# EAGLE design RPI_M_LED (EAGLE 7.6.0)
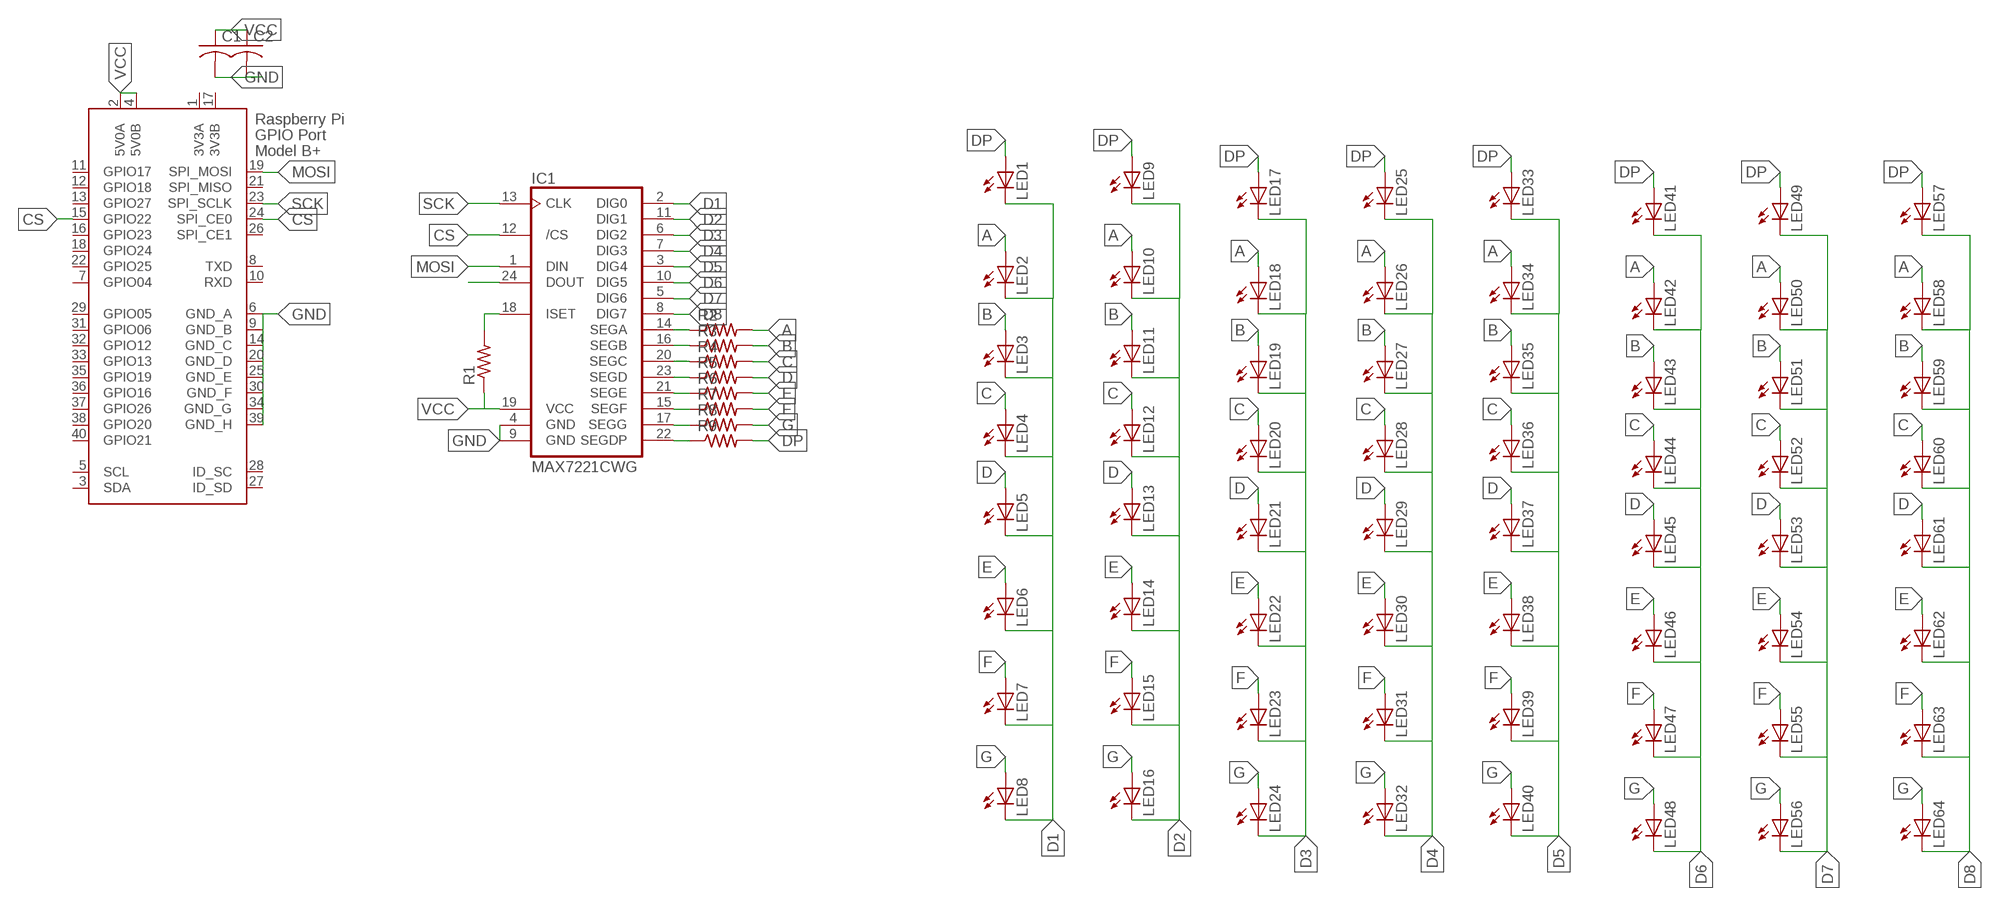
[diagram p0: schematic, sheet 1]

## Parts
C1  C-USC0805  [C0805]
C2  C-USC0805  [C0805]
IC1  MAX7221CWG  [SO24W]
LED1  LEDCHIPLED_0603  [CHIPLED_0603]
LED2  LEDCHIPLED_0603  [CHIPLED_0603]
LED3  LEDCHIPLED_0603  [CHIPLED_0603]
LED4  LEDCHIPLED_0603  [CHIPLED_0603]
LED5  LEDCHIPLED_0603  [CHIPLED_0603]
LED6  LEDCHIPLED_0603  [CHIPLED_0603]
LED7  LEDCHIPLED_0603  [CHIPLED_0603]
LED8  LEDCHIPLED_0603  [CHIPLED_0603]
LED9  LEDCHIPLED_0603  [CHIPLED_0603]
LED10  LEDCHIPLED_0603  [CHIPLED_0603]
LED11  LEDCHIPLED_0603  [CHIPLED_0603]
LED12  LEDCHIPLED_0603  [CHIPLED_0603]
LED13  LEDCHIPLED_0603  [CHIPLED_0603]
LED14  LEDCHIPLED_0603  [CHIPLED_0603]
LED15  LEDCHIPLED_0603  [CHIPLED_0603]
LED16  LEDCHIPLED_0603  [CHIPLED_0603]
LED17  LEDCHIPLED_0603  [CHIPLED_0603]
LED18  LEDCHIPLED_0603  [CHIPLED_0603]
LED19  LEDCHIPLED_0603  [CHIPLED_0603]
LED20  LEDCHIPLED_0603  [CHIPLED_0603]
LED21  LEDCHIPLED_0603  [CHIPLED_0603]
LED22  LEDCHIPLED_0603  [CHIPLED_0603]
LED23  LEDCHIPLED_0603  [CHIPLED_0603]
LED24  LEDCHIPLED_0603  [CHIPLED_0603]
LED25  LEDCHIPLED_0603  [CHIPLED_0603]
LED26  LEDCHIPLED_0603  [CHIPLED_0603]
LED27  LEDCHIPLED_0603  [CHIPLED_0603]
LED28  LEDCHIPLED_0603  [CHIPLED_0603]
LED29  LEDCHIPLED_0603  [CHIPLED_0603]
LED30  LEDCHIPLED_0603  [CHIPLED_0603]
LED31  LEDCHIPLED_0603  [CHIPLED_0603]
LED32  LEDCHIPLED_0603  [CHIPLED_0603]
LED33  LEDCHIPLED_0603  [CHIPLED_0603]
LED34  LEDCHIPLED_0603  [CHIPLED_0603]
LED35  LEDCHIPLED_0603  [CHIPLED_0603]
LED36  LEDCHIPLED_0603  [CHIPLED_0603]
LED37  LEDCHIPLED_0603  [CHIPLED_0603]
LED38  LEDCHIPLED_0603  [CHIPLED_0603]
LED39  LEDCHIPLED_0603  [CHIPLED_0603]
LED40  LEDCHIPLED_0603  [CHIPLED_0603]
LED41  LEDCHIPLED_0603  [CHIPLED_0603]
LED42  LEDCHIPLED_0603  [CHIPLED_0603]
LED43  LEDCHIPLED_0603  [CHIPLED_0603]
LED44  LEDCHIPLED_0603  [CHIPLED_0603]
LED45  LEDCHIPLED_0603  [CHIPLED_0603]
LED46  LEDCHIPLED_0603  [CHIPLED_0603]
LED47  LEDCHIPLED_0603  [CHIPLED_0603]
LED48  LEDCHIPLED_0603  [CHIPLED_0603]
LED49  LEDCHIPLED_0603  [CHIPLED_0603]
LED50  LEDCHIPLED_0603  [CHIPLED_0603]
LED51  LEDCHIPLED_0603  [CHIPLED_0603]
LED52  LEDCHIPLED_0603  [CHIPLED_0603]
LED53  LEDCHIPLED_0603  [CHIPLED_0603]
LED54  LEDCHIPLED_0603  [CHIPLED_0603]
LED55  LEDCHIPLED_0603  [CHIPLED_0603]
LED56  LEDCHIPLED_0603  [CHIPLED_0603]
LED57  LEDCHIPLED_0603  [CHIPLED_0603]
LED58  LEDCHIPLED_0603  [CHIPLED_0603]
LED59  LEDCHIPLED_0603  [CHIPLED_0603]
LED60  LEDCHIPLED_0603  [CHIPLED_0603]
LED61  LEDCHIPLED_0603  [CHIPLED_0603]
LED62  LEDCHIPLED_0603  [CHIPLED_0603]
LED63  LEDCHIPLED_0603  [CHIPLED_0603]
LED64  LEDCHIPLED_0603  [CHIPLED_0603]
R1  R-US_R0805  [R0805]
R2  R-US_R0603  [R0603]
R3  R-US_R0603  [R0603]
R4  R-US_R0603  [R0603]
R5  R-US_R0603  [R0603]
R6  R-US_R0603  [R0603]
R7  R-US_R0603  [R0603]
R8  R-US_R0603  [R0603]
R9  R-US_R0603  [R0603]
X1  RASPI_GPIO_B+#_PIN  [RASPI_GPIO_B+_PIN]

## Nets
A: LED2.A LED10.A LED18.A LED26.A LED34.A LED42.A LED50.A LED58.A R2.2
B: LED3.A LED11.A LED19.A LED27.A LED35.A LED43.A LED51.A LED59.A R3.2
C: LED4.A LED12.A LED20.A LED28.A LED36.A LED44.A LED52.A LED60.A R4.2
CS: IC1.12(/CS) X1.15(GPIO22) X1.24(SPI_CE0)
D: LED5.A LED13.A LED21.A LED29.A LED37.A LED45.A LED53.A LED61.A R5.2
D1: IC1.2(DIG0) LED1.C LED2.C LED3.C LED4.C LED5.C LED6.C LED7.C LED8.C
D2: IC1.11(DIG1) LED9.C LED10.C LED11.C LED12.C LED13.C LED14.C LED15.C LED16.C
D3: IC1.6(DIG2) LED17.C LED18.C LED19.C LED20.C LED21.C LED22.C LED23.C LED24.C
D4: IC1.7(DIG3) LED25.C LED26.C LED27.C LED28.C LED29.C LED30.C LED31.C LED32.C
D5: IC1.3(DIG4) LED33.C LED34.C LED35.C LED36.C LED37.C LED38.C LED39.C LED40.C
D6: IC1.10(DIG5) LED41.C LED42.C LED43.C LED44.C LED45.C LED46.C LED47.C LED48.C
D7: IC1.5(DIG6) LED49.C LED50.C LED51.C LED52.C LED53.C LED54.C LED55.C LED56.C
D8: IC1.8(DIG7) LED57.C LED58.C LED59.C LED60.C LED61.C LED62.C LED63.C LED64.C
DP: LED1.A LED9.A LED17.A LED25.A LED33.A LED41.A LED49.A LED57.A R9.2
E: LED6.A LED14.A LED22.A LED30.A LED38.A LED46.A LED54.A LED62.A R6.2
F: LED7.A LED15.A LED23.A LED31.A LED39.A LED47.A LED55.A LED63.A R7.2
G: LED8.A LED16.A LED24.A LED32.A LED40.A LED48.A LED56.A LED64.A R8.2
GND: C1.2 C2.2 IC1.4(GND) IC1.9(GND) X1.6(GND_A) X1.9(GND_B) X1.14(GND_C) X1.20(GND_D) X1.25(GND_E) X1.30(GND_F) X1.34(GND_G) X1.39(GND_H)
MOSI: IC1.1(DIN) X1.19(SPI_MOSI)
N$1: IC1.14(SEGA) R2.1
N$2: IC1.16(SEGB) R3.1
N$3: IC1.20(SEGC) R4.1
N$4: IC1.24(DOUT)
N$5: IC1.23(SEGD) R5.1
N$6: IC1.21(SEGE) R6.1
N$7: IC1.18(ISET) R1.2
N$8: IC1.15(SEGF) R7.1
N$9: IC1.17(SEGG) R8.1
N$10: IC1.22(SEGDP) R9.1
SCK: IC1.13(CLK) X1.23(SPI_SCLK)
VCC: C1.1 C2.1 IC1.19(VCC) R1.1 X1.2(5V0A) X1.4(5V0B)
Unconnected: X1.3(SDA) X1.5(SCL) X1.7(GPIO04) X1.8(TXD) X1.10(RXD) X1.11(GPIO17) X1.12(GPIO18) X1.13(GPIO27) X1.16(GPIO23) X1.18(GPIO24) X1.21(SPI_MISO) X1.22(GPIO25) X1.26(SPI_CE1) X1.27(ID_SD) X1.28(ID_SC) X1.29(GPIO05) X1.31(GPIO06) X1.32(GPIO12) X1.33(GPIO13) X1.35(GPIO19) X1.36(GPIO16) X1.37(GPIO26) X1.38(GPIO20) X1.40(GPIO21)

## Power pins joined to a net without a drawn wire
3V3A: X1.1(3V3A)
3V3B: X1.17(3V3B)

## Library data of the parts
C1 C2 = adafruit:C-US: CAPACITOR, American symbol
IC1 = maxim-8:MAX7221*: Serially Interfaced, 8-Digit LED Display Drivers
LED1-LED64 = adafruit:LED: LED OSRAM: - CHIPLED LG R971, LG N971, LY N971, LG Q971, LY Q971, LO R971, LY R971 LH N974, LH R974 LS Q976, LO Q976, LY Q976 LO Q996 - Hyper CHIPLED LW Q18S LB Q993, LB Q99A, LB R99A - SideLED LS A670, LO A670, LY A670, LG A670, LP A670 LB A673, LV A673, LT A673, LW A673 LH A674 LY A675 LS A676, LA A676, LO A676, LY A676, LW A676 LS A679, LY A679, LG A679 - Hyper Micro SIDELED® LS Y876, LA Y876, LO Y876, LY Y876 LT Y87S - SmartLED LW L88C, LW L88S LB L89C, LB L89S, LG L890 LS L89K, LO L89K, LY L89K LS L896, LA L896, LO L896, LY L896 - TOPLED LS T670, LO T670, LY T670, LG T670, LP T670 LSG T670, LSP T670, LSY T670, LOP T670, LYG T670 LG T671, LOG T671, LSG T671 LB T673, LV T673, LT T673, LW T673 LH T674 LS T676, LA T676, LO T676, LY T676, LB T676, LH T676, LSB T676, LW T676 LB T67C, LV T67C, LT T67C, LS T67K, LO T67K, LY T67K, LW E67C LS E67B, LA E67B, LO E67B, LY E67B, LB E67C, LV E67C, LT E67C LW T67C LS T679, LY T679, LG T679 LS T770, LO T770, LY T770, LG T770, LP T770 LB T773, LV T773, LT T773, LW T773 LH T774 LS E675, LA E675, LY E675, LS T675 LS T776, LA T776, LO T776, LY T776, LB T776 LHGB T686 LT T68C, LB T68C - Hyper Mini TOPLED® LB M676 - Mini TOPLED Santana® LG M470 LS M47K, LO M47K, LY M47K Source: http://www.osram.convergy.de/
R1-R9 = adafruit:R-US_: RESISTOR, American symbol
X1 = raspberrypi_bastelstube_v13:RASPI_GPIO_B+#: 2x20 header connector, all pins connected

## Board
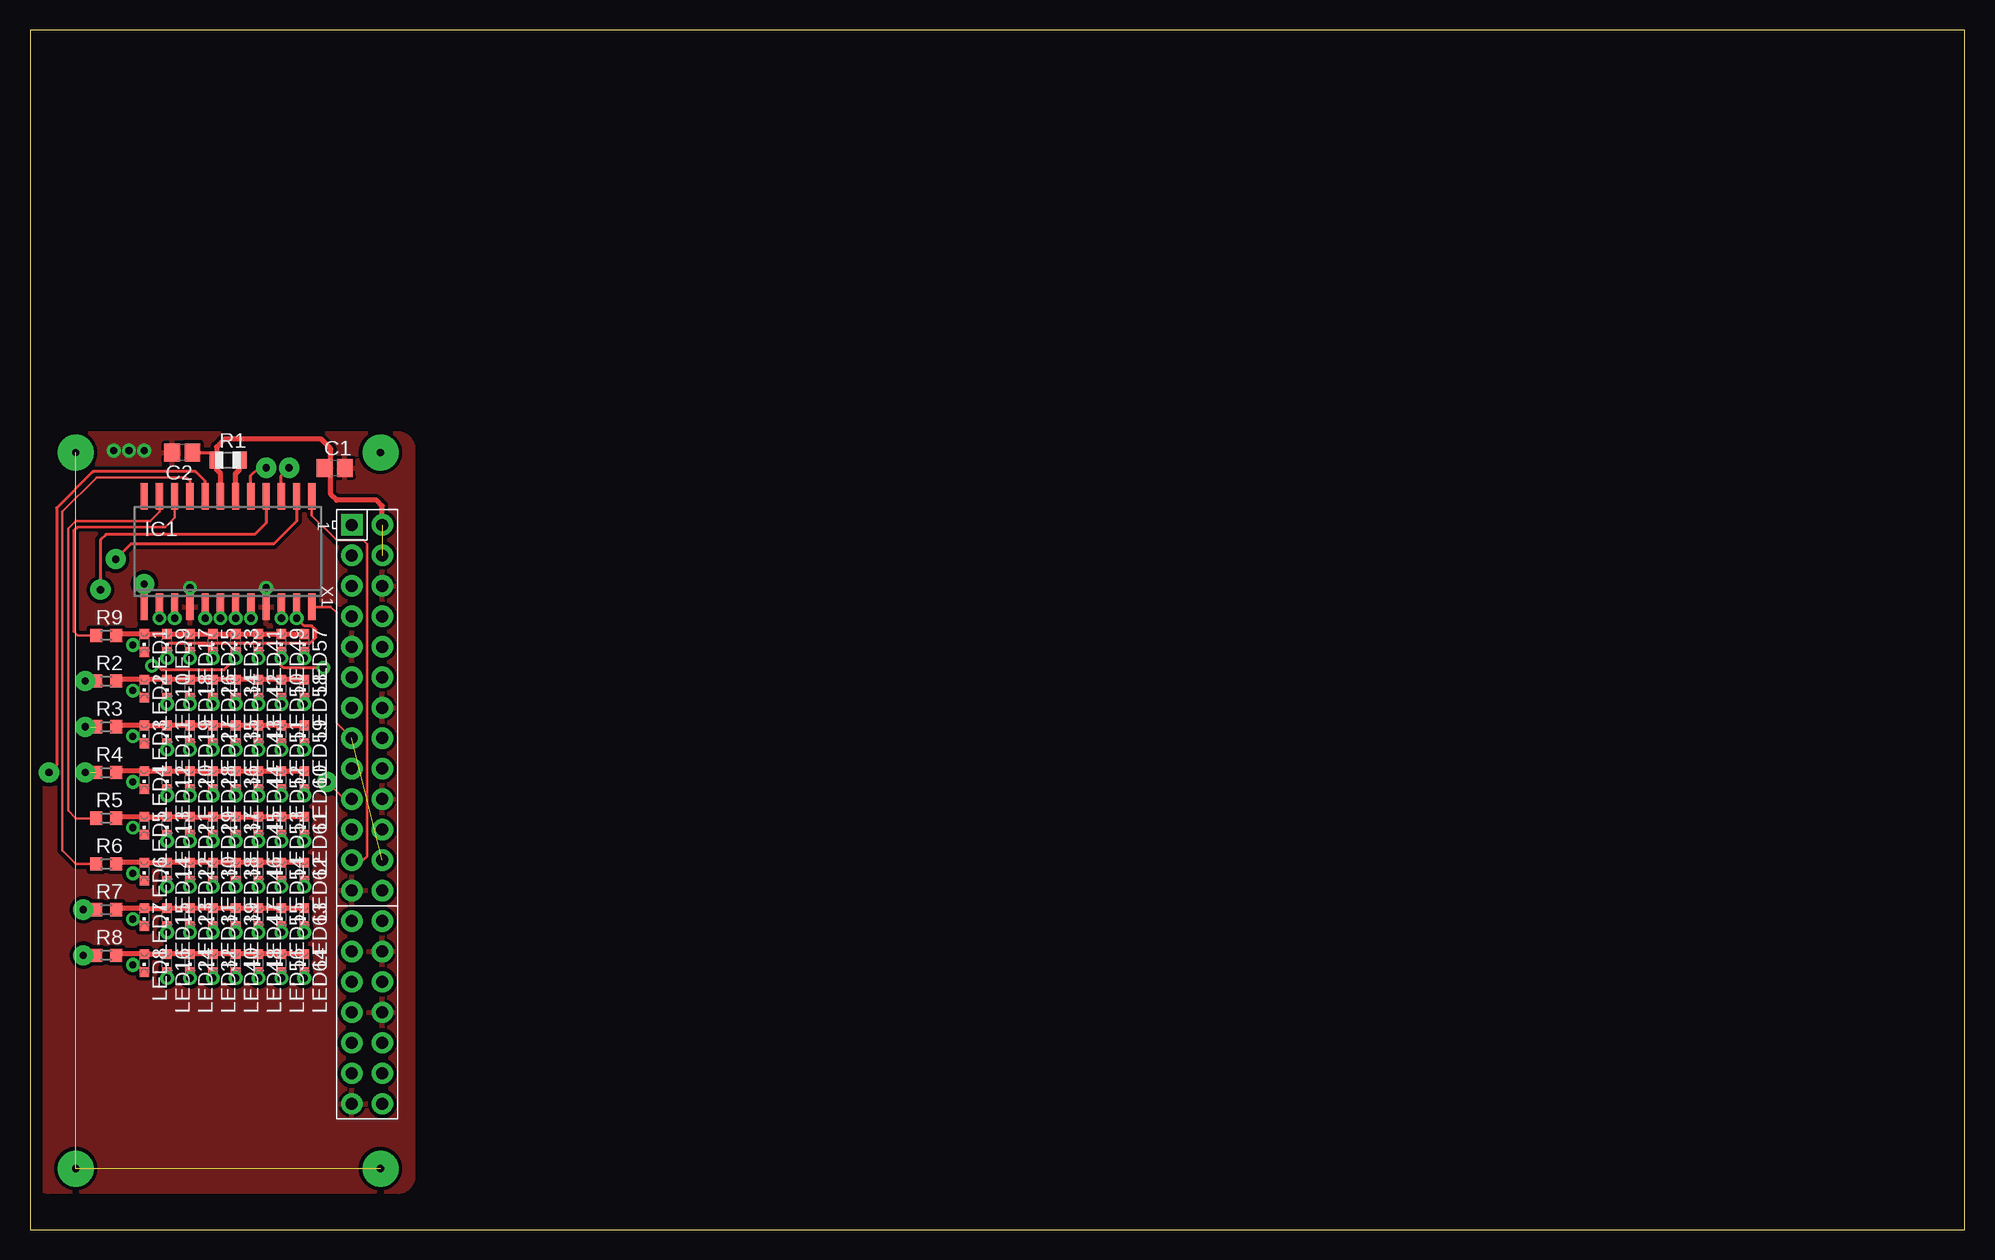
[diagram p1: board, top side]
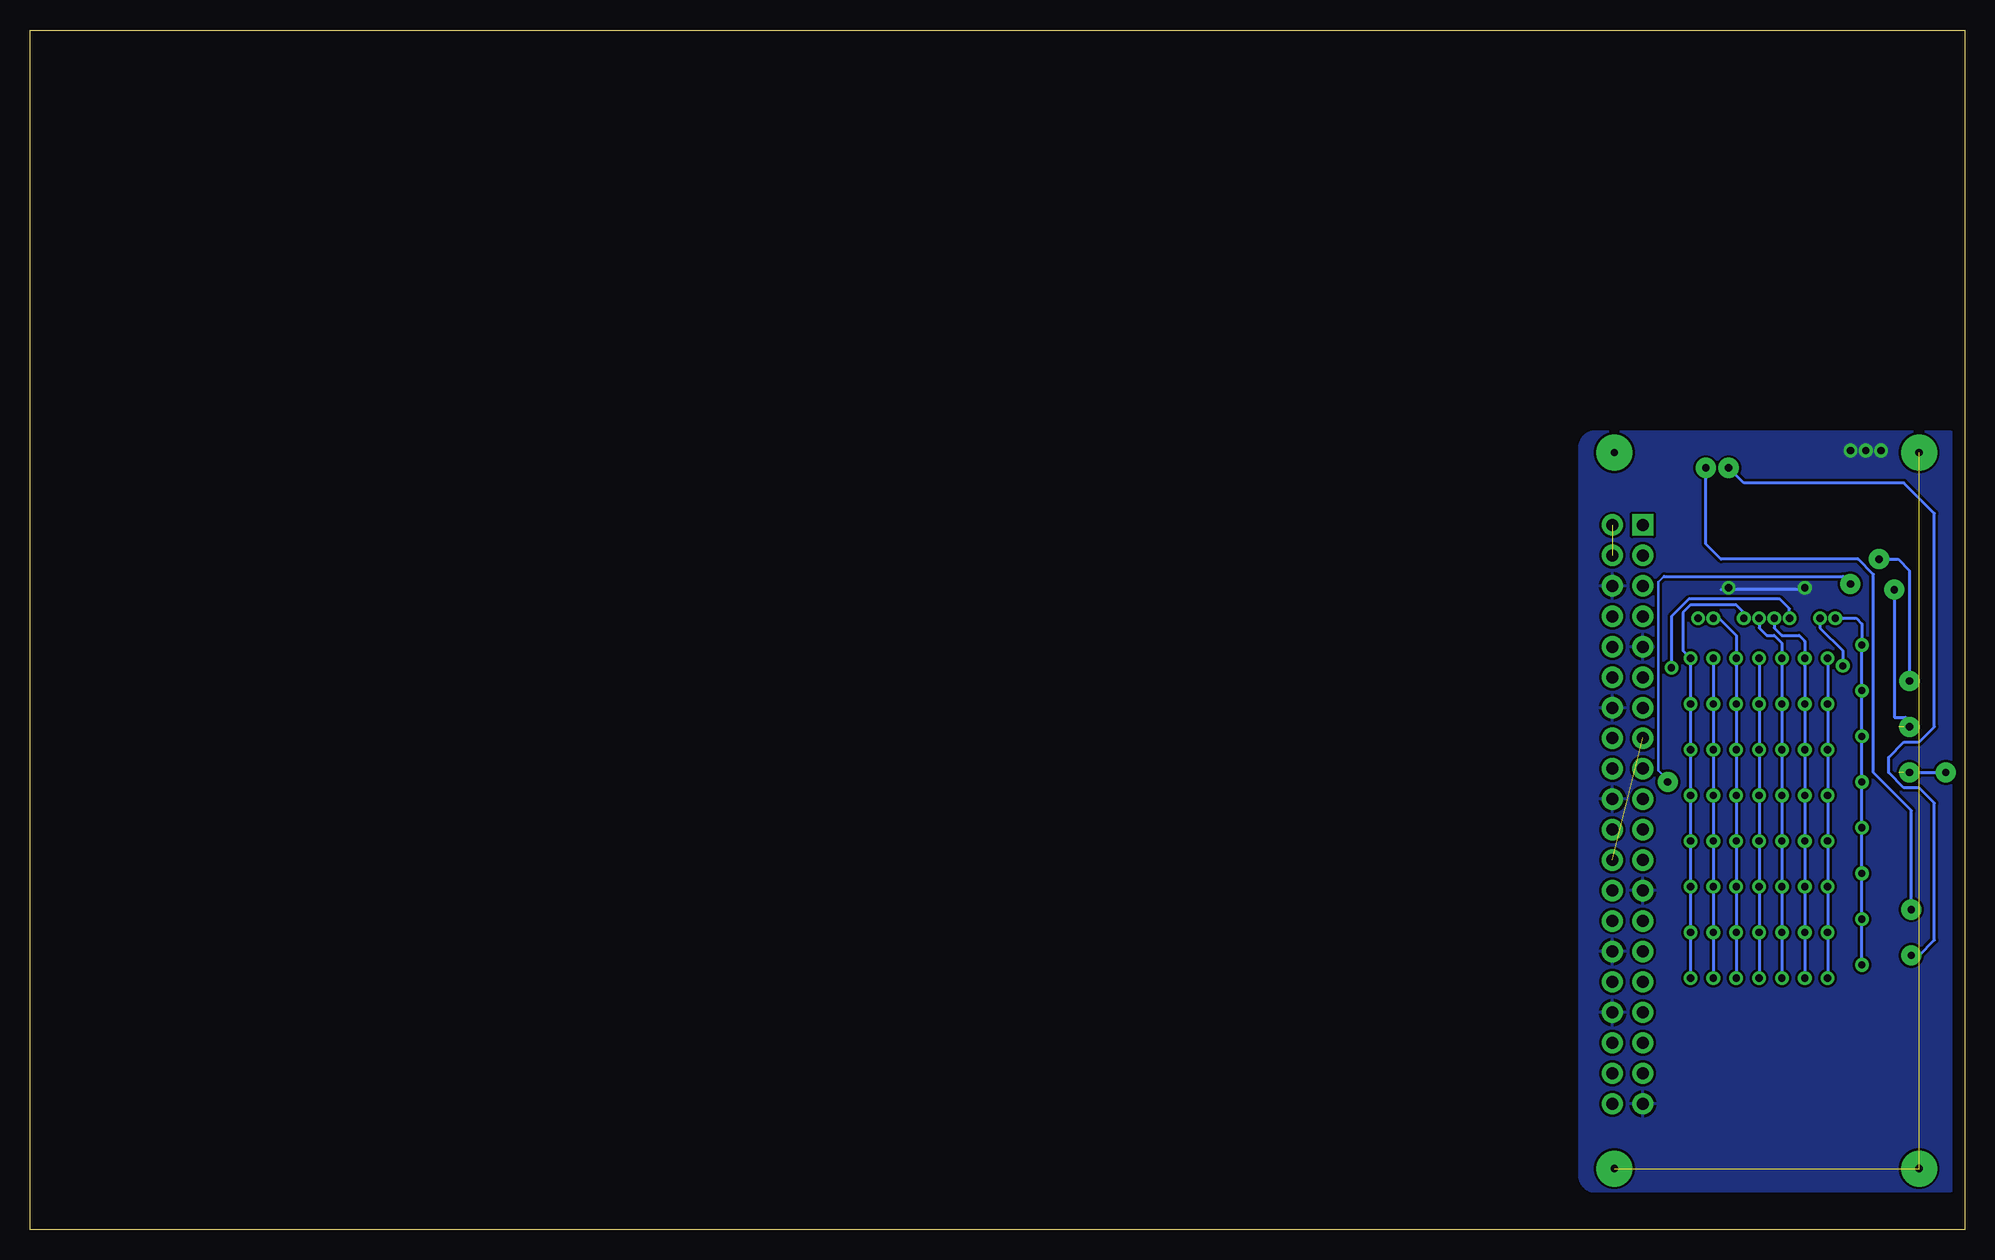
[diagram p2: board, bottom side, seen from below]

Size 161.27 x 100 mm. Coordinates in mm from the lower left corner, seen from the top.
Outline: 0,0 161.27,0 161.27,100 0,100 0,0
Copper layers (1*16): Top 0.035mm / dielectric 1.5mm / Bottom 0.035mm
Design rules "default": minimum track width 10mil, minimum drill 24mil, track to track 8mil, track to pad 8mil, pad to pad 8mil, via to via 8mil, smd to smd 8mil, copper to edge 40mil, drill to drill 8mil, minimum pad ring 10mil, minimum via ring 8mil, stop-mask expansion 4mil, vias tented up to drill 0mil, thermal gap 10mil

### Footprints (pad centres in the part's own frame; a part is rotated, then mirrored left to right if it is on the bottom)
C0805 = smd 1.3 x 1.5: 1 -0.85,0; 2 0.85,0
SO24W = smd 0.6 x 2.2: 1 -6.985,-4.6; 2 -5.715,-4.6; 3 -4.445,-4.6; 4 -3.175,-4.6; 5 -1.905,-4.6; 6 -0.635,-4.6; 7 0.635,-4.6; 8 1.905,-4.6; 9 3.175,-4.6; 10 4.445,-4.6; 11 5.715,-4.6; 12 6.985,-4.6; 13 6.985,4.6; 14 5.715,4.6; 15 4.445,4.6; 16 3.175,4.6; 17 1.905,4.6; 18 0.635,4.6; 19 -0.635,4.6; 20 -1.905,4.6; 21 -3.175,4.6; 22 -4.445,4.6; 23 -5.715,4.6; 24 -6.985,4.6
CHIPLED_0603 = smd 0.8 x 0.8: A 0,-0.75; C 0,0.75
R0805 = smd 1.1 x 1.4: 1 -1,0; 2 1,0
R0603 = smd 1 x 1.1: 1 -0.85,0; 2 0.85,0
RASPI_GPIO_B+_PIN = drill 1 pad 1.778 square: 1 -24.13,-1.27 | drill 1 pad 1.778: 2 -24.13,1.27; 3 -21.59,-1.27; 4 -21.59,1.27; 5 -19.05,-1.27; 6 -19.05,1.27; 7 -16.51,-1.27; 8 -16.51,1.27; 9 -13.97,-1.27; 10 -13.97,1.27; 11 -11.43,-1.27; 12 -11.43,1.27; 13 -8.89,-1.27; 14 -8.89,1.27; 15 -6.35,-1.27; 16 -6.35,1.27; 17 -3.81,-1.27; 18 -3.81,1.27; 19 -1.27,-1.27; 20 -1.27,1.27; 21 1.27,-1.27; 22 1.27,1.27; 23 3.81,-1.27; 24 3.81,1.27; 25 6.35,-1.27; 26 6.35,1.27; 27 8.89,-1.27; 28 8.89,1.27; 29 11.43,-1.27; 30 11.43,1.27; 31 13.97,-1.27; 32 13.97,1.27; 33 16.51,-1.27; 34 16.51,1.27; 35 19.05,-1.27; 36 19.05,1.27; 37 21.59,-1.27; 38 21.59,1.27; 39 24.13,-1.27; 40 24.13,1.27

### Placement (x,y rotation side)
C1  25.4,63.5 0 top
C2  12.7,64.77 180 top
IC1  16.51,56.52 0 top
LED1  9.53,48.9 180 top
LED2  9.53,45.09 180 top
LED3  9.53,41.27 180 top
LED4  9.53,37.47 180 top
LED5  9.53,33.66 180 top
LED6  9.53,29.84 180 top
LED7  9.53,26.04 180 top
LED8  9.53,22.23 180 top
LED9  11.43,48.9 180 top
LED10  11.43,45.09 180 top
LED11  11.43,41.27 180 top
LED12  11.43,37.47 180 top
LED13  11.43,33.66 180 top
LED14  11.43,29.84 180 top
LED15  11.43,26.04 180 top
LED16  11.43,22.23 180 top
LED17  13.33,48.9 180 top
LED18  13.33,45.09 180 top
LED19  13.33,41.27 180 top
LED20  13.33,37.47 180 top
LED21  13.33,33.66 180 top
LED22  13.33,29.84 180 top
LED23  13.33,26.04 180 top
LED24  13.33,22.23 180 top
LED25  15.24,48.9 180 top
LED26  15.24,45.09 180 top
LED27  15.24,41.27 180 top
LED28  15.24,37.47 180 top
LED29  15.24,33.66 180 top
LED30  15.24,29.84 180 top
LED31  15.24,26.04 180 top
LED32  15.24,22.23 180 top
LED33  17.14,48.9 180 top
LED34  17.14,45.09 180 top
LED35  17.14,41.27 180 top
LED36  17.14,37.47 180 top
LED37  17.14,33.66 180 top
LED38  17.14,29.84 180 top
LED39  17.14,26.04 180 top
LED40  17.14,22.23 180 top
LED41  19.05,48.9 180 top
LED42  19.05,45.09 180 top
LED43  19.05,41.27 180 top
LED44  19.05,37.47 180 top
LED45  19.05,33.66 180 top
LED46  19.05,29.84 180 top
LED47  19.05,26.04 180 top
LED48  19.05,22.23 180 top
LED49  20.95,48.9 180 top
LED50  20.95,45.09 180 top
LED51  20.95,41.27 180 top
LED52  20.95,37.47 180 top
LED53  20.95,33.66 180 top
LED54  20.95,29.84 180 top
LED55  20.95,26.04 180 top
LED56  20.95,22.23 180 top
LED57  22.86,48.9 180 top
LED58  22.86,45.09 180 top
LED59  22.86,41.27 180 top
LED60  22.86,37.47 180 top
LED61  22.86,33.66 180 top
LED62  22.86,29.84 180 top
LED63  22.86,26.04 180 top
LED64  22.86,22.23 180 top
R1  16.51,64.14 0 top
R2  6.35,45.72 0 top
R3  6.35,41.91 0 top
R4  6.35,38.1 0 top
R5  6.35,34.29 0 top
R6  6.35,30.48 0 top
R7  6.35,26.67 0 top
R8  6.35,22.86 0 top
R9  6.35,49.53 0 top
X1  28.1,34.61 270 top

### Tracks (layer width: path | path; a pad name or v marks a point on that pad's centre or on a via)
A
  Top 0.406: LED58.A LED50.A LED42.A LED34.A LED26.A LED18.A LED10.A LED2.A 7.2,45.84 R2.2
B
  Top 0.406: LED59.A LED51.A LED43.A LED35.A LED27.A LED19.A LED11.A LED3.A 7.2,42.02 R3.2
C
  Top 0.406: R4.2 7.2,38.22 LED4.A LED12.A LED20.A LED28.A LED36.A LED44.A | LED44.A 19.05,38.1 | LED44.A LED52.A LED60.A
CS  (1 unrouted)
  Top 0.203: IC1.12 25.08,51.91 25.56,51.44 25.56,42.23 X1.15
D
  Top 0.406: LED61.A LED53.A LED45.A LED37.A LED29.A LED21.A LED13.A LED5.A 7.2,34.41 R5.2
D1  (via drill 0.6 pad 1.14)
  Top 0.254: IC1.2 v10.79,50.96 | v8.57,48.74 8.93,48.74 LED1.C | LED3.C 8.93,41.12 v8.57,41.12 | LED4.C 8.93,37.31 v8.57,37.31 | LED5.C 8.93,33.5 v8.57,33.5 | LED6.C 8.93,29.69 v8.57,29.69 | LED7.C 8.93,25.88 v8.57,25.88 | LED8.C 8.93,22.07 v8.57,22.07 | LED2.C 8.93,44.93 v8.57,44.93
  Bottom 0.254: v10.79,50.96 9.05,50.96 8.57,50.48 v8.57,48.74 v8.57,44.93 v8.57,41.12 v8.57,37.31 v8.57,33.5 v8.57,29.69 v8.57,25.88 v8.57,22.07
D2  (via drill 0.6 pad 1.14)
  Top 0.254: IC1.11 v22.22,50.96 22.86,50.32 23.5,50.32 23.81,50.01 23.81,49.37 23.34,48.9 11.59,48.9 11.43,48.74 LED9.C v11.43,47.62 | LED16.C v11.43,20.95 | LED15.C v11.43,24.77 | LED14.C v11.43,28.57 | v11.43,32.38 LED13.C | v11.43,36.2 LED12.C | LED11.C v11.43,40.01 | LED10.C v11.43,43.81
  Bottom 0.254: v11.43,47.62 v11.43,43.81 v11.43,40.01 v11.43,36.2 v11.43,32.38 v11.43,28.57 v11.43,24.77 v11.43,20.95
D3  (via drill 0.6 pad 1.14)
  Top 0.254: IC1.6 v15.88,50.96 | LED17.C v13.33,47.62 | LED24.C v13.33,20.95 | LED23.C v13.33,24.77 | v13.33,28.57 LED22.C | v13.33,32.38 LED21.C | v13.33,36.2 LED20.C | v13.33,40.01 LED19.C | LED18.C v13.33,43.81
  Bottom 0.254: v13.33,20.95 v13.33,24.77 v13.33,28.57 v13.33,32.38 v13.33,36.2 v13.33,40.01 v13.33,43.81 13.33,46.99 v13.33,47.62 13.33,49.05 13.81,49.53 15.24,49.53 15.88,50.16 v15.88,50.96
D4  (via drill 0.6 pad 1.14)
  Top 0.254: IC1.7 v17.14,50.96 | LED25.C v15.24,47.62 | v15.24,20.95 LED32.C | LED31.C v15.24,24.77 | v15.24,28.57 LED30.C | v15.24,32.38 LED29.C | v15.24,36.2 LED28.C | v15.24,40.01 LED27.C | v15.24,43.81 LED26.C
  Bottom 0.254: v15.24,20.95 v15.24,24.77 v15.24,28.57 v15.24,32.38 v15.24,36.2 v15.24,40.01 v15.24,43.81 v15.24,47.62 15.24,48.9 15.88,49.53 16.51,49.53 17.14,50.16 v17.14,50.96
D5  (via drill 0.6 pad 1.14)
  Top 0.254: IC1.3 v12.06,50.96 | LED33.C v17.14,47.62 16.19,46.67 10.95,46.67 10.64,46.99 v10.16,46.99 | v17.14,20.95 LED40.C | LED39.C v17.14,24.77 | v17.14,28.57 LED38.C | LED37.C v17.14,32.38 | LED36.C v17.14,36.2 | v17.14,40.01 LED35.C | LED34.C v17.14,43.81
  Bottom 0.254: v17.14,20.95 v17.14,24.77 v17.14,28.57 v17.14,32.38 v17.14,36.2 v17.14,40.01 v17.14,43.81 v17.14,47.62 | v12.06,50.96 12.06,50.16 10.16,48.26 v10.16,46.99
D6  (via drill 0.6 pad 1.14)
  Top 0.254: IC1.10 v20.95,50.96 | LED41.C v19.05,47.62 | v19.05,20.95 LED48.C | LED47.C v19.05,24.77 | v19.05,28.57 LED46.C | v19.05,32.38 LED45.C | v19.05,36.2 LED44.C | v19.05,40.01 LED43.C | v19.05,43.81 LED42.C
  Bottom 0.254: v19.05,20.95 v19.05,24.77 v19.05,28.57 v19.05,32.38 v19.05,36.2 v19.05,40.01 v19.05,43.81 19.05,46.99 v19.05,47.62 19.05,49.53 20.48,50.96 v20.95,50.96
D7  (via drill 0.6 pad 1.14)
  Top 0.254: IC1.5 v14.61,50.96 | v20.95,47.62 LED49.C 20.95,46.99 21.11,46.83 v24.45,46.83 | v20.95,20.95 LED56.C | LED55.C v20.95,24.77 | v20.95,28.57 LED54.C | LED53.C v20.95,32.38 | v20.95,36.2 LED52.C | LED51.C v20.95,40.01 | LED50.C v20.95,43.81
  Bottom 0.254: v20.95,20.95 v20.95,24.77 v20.95,28.57 v20.95,32.38 v20.95,36.2 v20.95,40.01 v20.95,43.81 v20.95,47.62 | v14.61,50.96 14.61,51.75 15.4,52.55 23.02,52.55 24.45,51.12 v24.45,46.83
D8  (via drill 0.6 pad 1.14)
  Top 0.254: IC1.8 v18.41,50.96 | LED57.C v22.86,47.62 | v22.86,20.95 LED64.C | LED63.C v22.86,24.77 | v22.86,28.57 LED62.C | LED61.C v22.86,32.38 | v22.86,36.2 LED60.C | v22.86,40.01 LED59.C | v22.86,43.81 LED58.C
  Bottom 0.254: v22.86,20.95 v22.86,24.77 v22.86,28.57 v22.86,32.38 v22.86,36.2 v22.86,40.01 v22.86,43.81 v22.86,47.62 23.5,48.26 23.5,51.44 22.86,52.07 19.05,52.07 18.41,51.44 v18.41,50.96
DP
  Top 0.406: LED57.A LED49.A LED41.A LED33.A LED25.A LED17.A LED9.A LED1.A 7.2,49.65 R9.2
E
  Top 0.406: LED62.A LED54.A LED46.A LED38.A LED30.A LED22.A LED14.A LED6.A 7.2,30.59 R6.2
F
  Top 0.406: LED63.A LED55.A LED47.A LED39.A LED31.A LED23.A LED15.A LED7.A 7.2,26.79 R7.2
G
  Top 0.406: LED64.A LED56.A LED48.A LED40.A LED32.A LED24.A LED16.A LED8.A 7.2,22.98 R8.2
GND  (via drill 0.6 pad 1.14)
  Top 0.254: IC1.9 v19.68,53.5 19.84,53.34 | 19.84,53.34 20.32,53.34 | 19.84,53.34 19.05,53.34
  Bottom 0.254: v13.33,53.5 13.49,53.34 20.32,53.34
  other vias: 9.53,64.93 8.26,64.93 6.98,64.93
  pour Top (isolate 0.305): 30.63,3.17 1.59,3.17 arc-90 0.32,4.45 0.32,65.08 arc-90 1.59,66.35 30.63,66.35 arc-90 31.91,65.08 31.91,4.45 arc-90
  pour Bottom: 0.16,65.25 0.16,4.45 arc90 1.43,3.17 30.8,3.17 arc90 32.07,4.45 32.07,65.25 arc90 30.8,66.52 1.43,66.52 arc90
MOSI  (via drill 0.6 pad 1.68)
  Top 0.203: v9.53,53.82 IC1.1 | X1.19 26.19,35.88 v24.77,37.31
  Bottom 0.203: v24.77,37.31 24.77,37.47 25.56,38.26 25.56,53.98 25.08,54.45
  Bottom 0.254: 25.08,54.45 10.16,54.45 v9.53,53.82
N$1  (via drill 0.6 pad 1.68)
  Top 0.203: R2.1 v4.6,45.72
  Top 0.254: IC1.14 22.22,59.05 20.32,57.15 8.41,57.15 v7.14,55.88
  Bottom 0.254: v7.14,55.88 5.56,55.88 4.6,54.93 v4.6,45.72
N$2  (via drill 0.6 pad 1.68)  (1 unrouted)
  Top 0.203: v4.6,41.91 5.08,41.91
  Top 0.254: IC1.16 19.68,58.9 18.73,57.94 6.35,57.94 5.87,57.47 v5.87,53.34
  Bottom 0.254: v5.87,53.34 5.87,42.7 4.92,42.7 4.6,42.39 v4.6,41.91
N$3  (via drill 0.6 pad 1.68)  (1 unrouted)
  Top 0.203: v4.6,38.1 5.08,38.1
  Top 0.254: IC1.20 14.61,62.39 13.81,63.18 5.24,63.18 2.22,60.17 2.22,38.73 v1.59,38.1
  Bottom 0.254: v4.6,38.1 v1.59,38.1
N$5
  Top 0.203: IC1.23 10.79,59.85 10,59.05 3.81,59.05 3.17,58.42 3.17,34.92 3.81,34.29 R5.1
N$6
  Top 0.203: IC1.21 13.33,62.39 13.02,62.71 5.56,62.71 2.7,59.85 2.7,31.59 3.81,30.48 R6.1
N$7
  Top 0.406: IC1.18 17.14,63.02 17.46,63.34 17.46,64.09 R1.2
N$8  (via drill 0.6 pad 1.68)
  Top 0.254: IC1.15 20.95,62.87 v21.59,63.5 | v4.45,26.67 R7.1
  Bottom 0.254: v4.45,26.67 4.45,34.92 7.62,38.1 7.62,54.61 8.89,55.88 20.32,55.88 21.59,57.15 v21.59,63.5
N$9  (via drill 0.6 pad 1.68)
  Top 0.254: IC1.17 18.41,62.87 19.05,63.5 v19.68,63.5 | v4.45,22.86 R8.1
  Bottom 0.254: v4.45,22.86 3.81,22.86 2.54,24.13 2.54,35.56 3.81,36.83 5.08,36.83 6.35,38.1 6.35,39.37 5.08,40.64 3.81,40.64 2.54,41.91 2.54,59.69 5.08,62.23 18.41,62.23 v19.68,63.5
N$10
  Top 0.203: IC1.22 12.06,59.37 11.27,58.58 3.97,58.58 3.65,58.26 3.65,49.85 3.97,49.53 R9.1
N$12  (via drill 0.6 pad 3)
  other vias: 29.21,64.77
N$13  (via drill 0.6 pad 3)  (2 unrouted)
  other vias: 3.81,64.77 3.81,5.08 29.21,5.08
SCK
  Top 0.203: IC1.13 23.5,59.53 25.56,57.47 27.78,57.47 28.1,57.15 28.1,31.11 27.78,30.8 X1.23
VCC  (1 unrouted)
  Top 0.254: C2.1 15.56,64.77 | C1.1 25.08,63.5
  Top 0.406: X1.2 29.37,60.32 28.89,60.8 25.56,60.8 25.08,61.28 25.08,63.5 25.08,65.09 24.29,65.88 16.19,65.88 15.56,65.25 15.56,64.77 15.56,64.18 R1.1 15.56,64.09 15.56,63.34 15.88,63.02 IC1.19